# Altium schematic sheet MiCore_PWR.SchDoc: MiCore - Power
size A4; DrawnBy: eleqian; Revision: 1.0; SheetNumber: 2; SheetTotal: 3
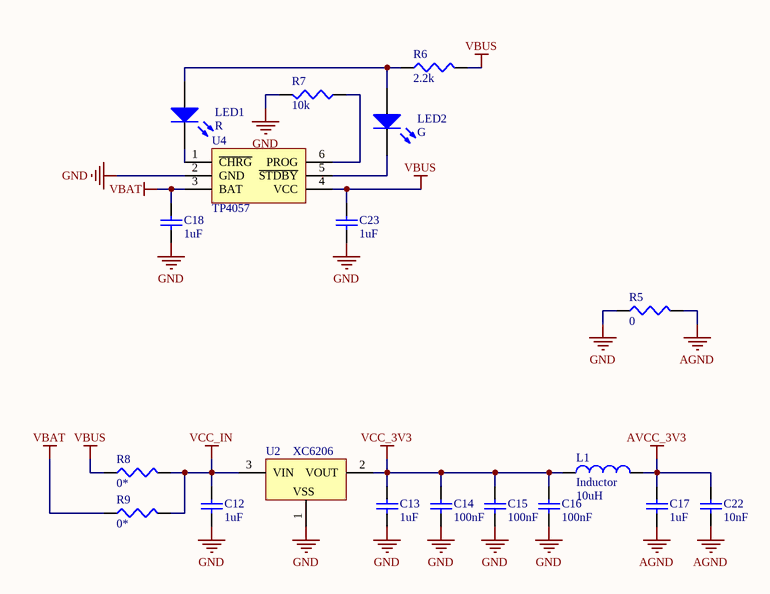
[diagram p0: MiCore_PWR.SchDoc]

## Parts
C12  value 1uF  [0603C]  (hidden comment: Cap)
C13  value 1uF  [0603C]  (hidden comment: Cap)
C14  value 100nF  [0603C]  (hidden comment: Cap)
C15  value 100nF  [0603C]  (hidden comment: Cap)
C16  value 100nF  [0603C]  (hidden comment: Cap)
C17  value 1uF  [0603C]  (hidden comment: Cap)
C18  value 1uF  [0603C]  (hidden comment: Cap)
C22  value 10nF  [0603C]  (hidden comment: Cap)
C23  value 1uF  [0603C]  (hidden comment: Cap)
L1  Inductor  value 10uH  [0805L]
LED1  R  [0603LED]
LED2  G  [0603LED]
R5  value 0  [0805R]  (hidden comment: Res3)
R6  value 2.2k  [0603R]  (hidden comment: Res3)
R7  value 10k  [0603R]  (hidden comment: Res3)
R8  value 0*  [0805R]  (hidden comment: Res3)
R9  value 0*  [0805R]  (hidden comment: Res3)
U2  XC6206  [SOT-23]
U4  TP4057  [SOT26A-6N]

## Nets
AGND: C17.2 C22.2 R5.2
AVCC_3V3: C17.1 C22.1 L1.2
GND: C12.2 C13.2 C14.2 C15.2 C16.2 C18.2 C23.1 R5.1 R7.2 U2.1(GND) U4.2(GND)
VBAT: C18.1 R9.1 U4.3(BAT)
VBUS: C23.2 R6.2 R8.1 U4.4(VCC)
VCC_3V3: C13.1 C14.1 C15.1 C16.1 L1.1 U2.2(VOUT)
VCC_IN: C12.1 R8.2 R9.2 U2.3(VIN)
NetLED1_1: LED1.1(A) LED2.1(A) R6.1
NetLED1_2: LED1.2(K) U4.1(~{CHRG})
NetLED2_2: LED2.2(K) U4.5(~{STDBY})
NetR7_1: R7.1 U4.6(PROG)

## Notes on the sheet
- (in symbol XC6206) VSS

## Library data of the parts
C12-C18 C22 C23 = Cap: Capacitor; Published: 8-Jun-2000; LatestRevisionDate: 17-Jul-2002; LatestRevisionNote: Re-released for DXP Platform.; PackageReference: RAD-0.3; Publisher: Altium Limited; PackageDescription: Radial Cap, Thru-Hole; 2 Leads; 0.3 in Pin Spacing
L1 = Inductor: Code_IEC: 1005; Published: 8-Jun-2000; LatestRevisionDate: 29-May-2009; LatestRevisionNote: IPC-7351 Footprint Added.; PackageReference: 0402-A; Publisher: Altium Limited; PackageDescription: Chip Inductor; Code_JEITA: 0402
LED1 = LED2: Typical RED LED; Published: 8-Jun-2000; LatestRevisionDate: 17-Jul-2002; LatestRevisionNote: Re-released for DXP Platform.; PackageVersion: Feb-2002; PackageReference: 3.2X1.6X1.1; Publisher: Altium Limited
LED2 = LED2: Typical GREEN LED; Published: 8-Jun-2000; LatestRevisionDate: 17-Jul-2002; LatestRevisionNote: Re-released for DXP Platform.; PackageVersion: Feb-2002; PackageReference: 3.2X1.6X1.1; Publisher: Altium Limited
R5-R9 = Res3: Resistor; Published: 8-Jun-2000; LatestRevisionDate: 29-May-2009; LatestRevisionNote: IPC-7351 Footprint Added.; PackageReference: J1-0603; Publisher: Altium Limited; PackageDescription: Chip Resistor
U2 = XC6206: LDO-3.3V
U4 = TP: 锂电池充电IC